# EAGLE schematic controll (EAGLE 8.0.0)

## Sheet 1 of 3
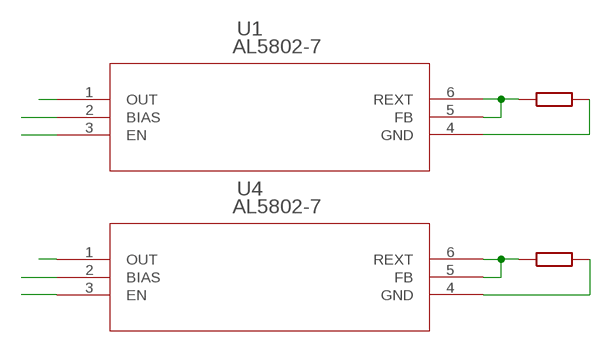
[diagram p0: schematic, sheet 1]

### Parts
U1  AL5802-7  [SOT26]
U4  AL5802-7  [SOT26]

### Nets
24V: U1.2(BIAS) U4.2(BIAS)
GND: U1.4(GND) ; also sheet 2,3
N$1: U1.1(OUT)
N$2: U4.5(FB) U4.6(REXT)
N$3: U1.5(FB) U1.6(REXT)
N$4: U4.4(GND)
N$5: U1.3(EN)
N$7: U4.3(EN)
N$8: U4.1(OUT)

## Sheet 2 of 3
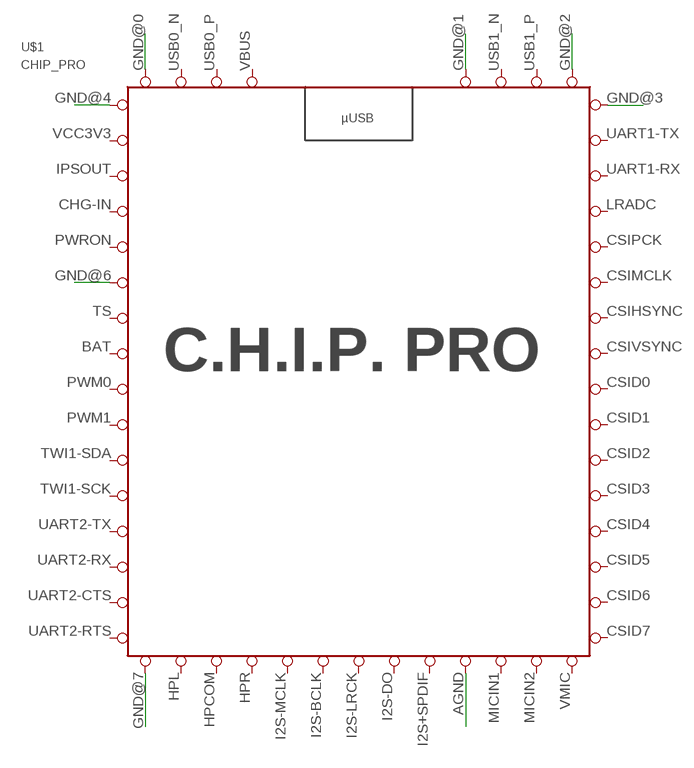
[diagram p1: schematic, sheet 2]

### Parts
U$1  CHIP_PRO  [CHIP_PRO]

### Nets
GND: U$1.AGND U$1.GND@0(GND) U$1.GND@1(GND) U$1.GND@2(GND) U$1.GND@3(GND) U$1.GND@4(GND) U$1.GND@6(GND) U$1.GND@7(GND) ; also sheet 1,3
Unconnected: U$1.BAT U$1.CSID0 U$1.CSID1 U$1.CSID2 U$1.CSID3 U$1.CSID4 U$1.CSID5 U$1.CSID6 U$1.CSID7 U$1.CSIHSYNC U$1.CSIMCLK U$1.CSIPCK U$1.CSIVSYNC U$1.HPCOM U$1.HPL U$1.HPR U$1.I2S+SPDIF(I2SSPDIF) U$1.I2S-BCLK(I2SBCLK) U$1.I2S-DO(I2SDO) U$1.I2S-LRCK(I2SLRCK) U$1.I2S-MCLK(I2SMCLK) U$1.LRADC U$1.MICIN1 U$1.MICIN2 U$1.PWM0 U$1.PWM1 U$1.PWRON U$1.TS U$1.TWI1-SCK U$1.TWI1-SDA U$1.UART1-RX U$1.UART1-TX U$1.UART2-CTS U$1.UART2-RTS U$1.UART2-RX U$1.UART2-TX U$1.USB0_N U$1.USB0_P U$1.USB1_N U$1.USB1_P U$1.VMIC

## Sheet 3 of 3
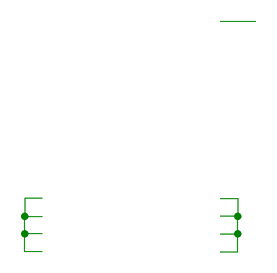
[diagram p2: schematic, sheet 3]

## Power pins joined to a net without a drawn wire
CHG-IN: U$1.CHG-IN
IPSOUT: U$1.IPSOUT
VBUS: U$1.VBUS
VCC3V3: U$1.VCC3V3

## Library data of the parts
U1 U4 = LED Driver:AL5802-7; MANUFACTURER_PART_NUMBER: al58027; VENDOR: Diodes Inc
U$1 = CHIP_Pro-Footprint:CHIP_PRO